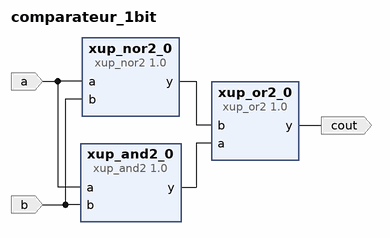
[diagram p0: block diagram of the top level]
# Vivado block design comparateur_1bit, xc7a100tcsg324-1, Vivado 2018.3
create_bd_design comparateur_1bit

create_bd_port -dir I a
create_bd_port -dir I b
create_bd_port -dir O cout

create_bd_cell -type ip -vlnv xilinx.com:xup:xup_and2:1.0 xup_and2_0
create_bd_cell -type ip -vlnv xilinx.com:xup:xup_nor2:1.0 xup_nor2_0
create_bd_cell -type ip -vlnv xilinx.com:xup:xup_or2:1.0 xup_or2_0

# ---- connections ----

connect_bd_net [get_bd_ports a] [get_bd_pins xup_and2_0/a] [get_bd_pins xup_nor2_0/a]
connect_bd_net [get_bd_ports b] [get_bd_pins xup_and2_0/b] [get_bd_pins xup_nor2_0/b]
connect_bd_net [get_bd_pins xup_and2_0/y] [get_bd_pins xup_or2_0/a]
connect_bd_net [get_bd_pins xup_nor2_0/y] [get_bd_pins xup_or2_0/b]
connect_bd_net [get_bd_pins xup_or2_0/y] [get_bd_ports cout]

validate_bd_design
save_bd_design
